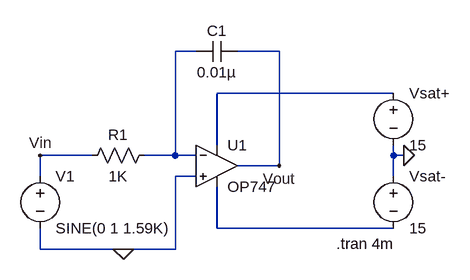
[diagram p0: schematic INTEGRATOR_IDEAL.asc]
INTEGRATOR_IDEAL.asc, the LTspice schematic file:
Version 4
SHEET 1 1584 680
WIRE 352 -16 320 -16
WIRE 480 -16 416 -16
WIRE 656 48 384 48
WIRE 384 128 384 48
WIRE 192 144 112 144
WIRE 320 144 320 -16
WIRE 320 144 272 144
WIRE 352 144 320 144
WIRE 656 144 656 128
WIRE 672 144 656 144
WIRE 480 160 480 -16
WIRE 480 160 416 160
WIRE 112 176 112 144
WIRE 352 176 320 176
WIRE 656 176 656 144
WIRE 384 256 384 192
WIRE 656 256 384 256
WIRE 112 288 112 256
WIRE 240 288 112 288
WIRE 320 288 320 176
WIRE 320 288 240 288
FLAG 672 144 0
FLAG 240 288 0
FLAG 112 144 Vin
FLAG 480 160 Vout
SYMBOL OpAmps\\OP747 384 96 R0
SYMATTR InstName U1
SYMBOL voltage 656 32 R0
WINDOW 123 0 0 Left 0
WINDOW 39 0 0 Left 0
SYMATTR InstName Vsat+
SYMATTR Value 15
SYMBOL voltage 656 160 R0
WINDOW 123 0 0 Left 0
WINDOW 39 0 0 Left 0
SYMATTR InstName Vsat-
SYMATTR Value 15
SYMBOL voltage 112 160 R0
WINDOW 123 0 0 Left 0
WINDOW 39 0 0 Left 0
SYMATTR InstName V1
SYMATTR Value SINE(0 1 1.59K)
SYMBOL res 288 128 R90
WINDOW 0 0 56 VBottom 2
WINDOW 3 32 56 VTop 2
SYMATTR InstName R1
SYMATTR Value 1K
SYMBOL cap 416 -32 R90
WINDOW 0 0 32 VBottom 2
WINDOW 3 32 32 VTop 2
SYMATTR InstName C1
SYMATTR Value 0.01µ
TEXT 568 280 Left 2 !.tran 4m

The netlist it stands for:
* INTEGRATOR_IDEAL.asc
XU1 0 N001 N002 N003 Vout OP747  ; pins In+ In- V+ V- OUT
Vsat+ N002 0 15
Vsat- 0 N003 15
V1 Vin 0 SINE(0 1 1.59K)
R1 N001 Vin 1K
C1 Vout N001 0.01µ
.tran 4m
.backanno
.end